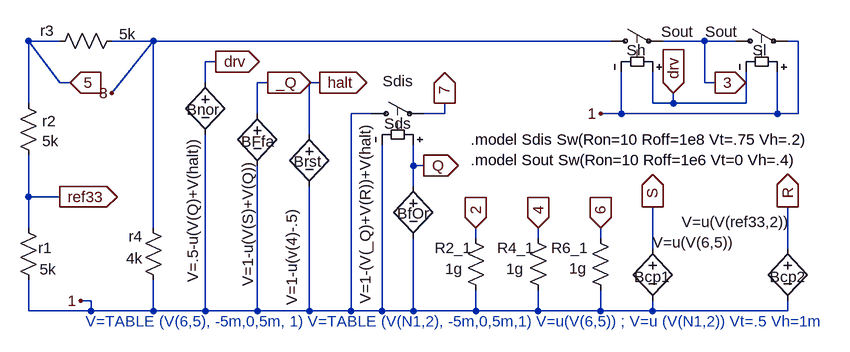
[diagram p0: schematic Lt555BehMin.asc]
Lt555BehMin.asc, the LTspice schematic file:
Version 4
SHEET 1 1704 916
WIRE -576 304 -576 208
WIRE -576 448 -576 384
WIRE -576 496 -576 448
WIRE -576 624 -576 576
WIRE -528 208 -576 208
WIRE -528 272 -576 208
WIRE -528 448 -576 448
WIRE -512 272 -528 272
WIRE -480 608 -496 608
WIRE -480 624 -576 624
WIRE -480 624 -480 608
WIRE -384 208 -448 208
WIRE -384 208 -448 288
WIRE -384 496 -384 208
WIRE -384 624 -480 624
WIRE -384 624 -384 576
WIRE -304 272 -304 240
WIRE -304 624 -384 624
WIRE -304 624 -304 352
WIRE -288 240 -304 240
WIRE -224 320 -224 272
WIRE -224 624 -304 624
WIRE -224 624 -224 400
WIRE -208 272 -224 272
WIRE -144 352 -144 272
WIRE -144 624 -224 624
WIRE -144 624 -144 432
WIRE -128 272 -144 272
WIRE -80 624 -144 624
WIRE -80 624 -80 320
WIRE -48 320 -80 320
WIRE -32 624 -80 624
WIRE -32 624 -32 368
WIRE 16 400 16 368
WIRE 16 432 16 400
WIRE 16 624 -32 624
WIRE 16 624 16 512
WIRE 32 400 16 400
WIRE 64 320 32 320
WIRE 64 320 64 304
WIRE 112 512 112 496
WIRE 112 624 16 624
WIRE 112 624 112 592
WIRE 208 512 208 496
WIRE 208 624 112 624
WIRE 208 624 208 592
WIRE 304 512 304 496
WIRE 304 624 208 624
WIRE 304 624 304 592
WIRE 320 208 -384 208
WIRE 336 320 304 320
WIRE 336 320 336 256
WIRE 384 304 384 256
WIRE 384 528 384 464
WIRE 384 624 304 624
WIRE 384 624 384 608
WIRE 416 304 384 304
WIRE 416 304 416 288
WIRE 464 208 400 208
WIRE 464 272 464 208
WIRE 480 272 464 272
WIRE 512 208 464 208
WIRE 528 304 416 304
WIRE 528 304 528 256
WIRE 576 320 336 320
WIRE 576 320 576 256
WIRE 592 528 592 464
WIRE 592 624 384 624
WIRE 592 624 592 608
WIRE 608 208 592 208
WIRE 608 320 576 320
WIRE 608 320 608 208
FLAG -528 448 ref33
IOPIN -528 448 Out
FLAG -512 272 5
IOPIN -512 272 In
FLAG 64 304 7
IOPIN 64 304 Out
FLAG 32 400 Q
IOPIN 32 400 Out
FLAG -448 288 8
FLAG 480 272 3
IOPIN 480 272 Out
FLAG 416 288 drv
IOPIN 416 288 In
FLAG -496 608 1
FLAG 208 496 4
IOPIN 208 496 In
FLAG 304 496 6
IOPIN 304 496 In
FLAG 384 464 S
IOPIN 384 464 Out
FLAG 112 496 2
IOPIN 112 496 In
FLAG 592 464 R
IOPIN 592 464 Out
FLAG -288 240 drv
IOPIN -288 240 Out
FLAG -208 272 _Q
IOPIN -208 272 Out
FLAG -128 272 halt
IOPIN -128 272 Out
FLAG 304 320 1
SYMBOL res -592 480 R0
WINDOW 0 31 47 Left 0
WINDOW 3 33 80 Left 0
SYMATTR InstName r1
SYMATTR Value 5k
SYMBOL res -592 288 R0
WINDOW 0 37 43 Left 0
WINDOW 3 37 74 Left 0
SYMATTR InstName r2
SYMATTR Value 5k
SYMBOL res -432 192 R90
WINDOW 0 16 115 VBottom 0
WINDOW 3 -10 -8 VTop 0
SYMATTR InstName r3
SYMATTR Value 5k
SYMBOL sw -64 320 R270
WINDOW 0 -15 35 VRight 0
WINDOW 3 50 33 VRight 0
SYMATTR InstName Sds
SYMATTR Value Sdis
SYMBOL sw 304 208 R270
WINDOW 0 -14 40 VRight 0
WINDOW 3 14 93 VRight 0
SYMATTR InstName Sh
SYMATTR Value Sout
SYMBOL sw 496 208 R270
WINDOW 0 -14 42 VRight 0
WINDOW 3 14 -31 VRight 0
SYMATTR InstName Sl
SYMATTR Value Sout
SYMBOL res -400 480 R0
WINDOW 0 -22 29 Left 0
WINDOW 3 -26 63 Left 0
SYMATTR InstName r4
SYMATTR Value 4k
SYMBOL res 96 496 R0
WINDOW 0 -47 31 Left 0
WINDOW 3 -31 63 Left 0
SYMATTR InstName R2_1
SYMATTR Value 1g
SYMBOL bv 384 512 R0
WINDOW 0 -28 59 Left 0
WINDOW 3 126 6 Right 0
SYMATTR InstName Bcp1
SYMATTR Value V=u(V(6,5))
SYMBOL bv 592 512 R0
WINDOW 0 -28 59 Left 0
WINDOW 3 -163 -25 Left 0
SYMATTR InstName Bcp2
SYMATTR Value V=u(V(ref33,2))
SYMBOL bv 16 416 R0
WINDOW 0 -25 58 Left 0
WINDOW 3 -74 -85 VRight 0
SYMATTR InstName BfOr
SYMATTR Value V=1-(V(_Q)+V(R))+V(halt)
SYMBOL bv -304 256 R0
WINDOW 0 -29 58 Left 0
WINDOW 3 -19 99 VRight 0
SYMATTR InstName Bnor
SYMATTR Value V=.5-u(V(Q)+V(halt))
SYMBOL bv -224 304 R0
WINDOW 0 -25 59 Left 0
WINDOW 3 -15 87 VRight 0
SYMATTR InstName BFfa
SYMATTR Value V=1-u(V(S)+V(Q))
SYMBOL bv -144 336 R0
WINDOW 0 -24 58 Left 0
WINDOW 3 -27 280 VLeft 0
SYMATTR InstName Brst
SYMATTR Value V=1-u(v(4)-.5)
SYMBOL res 288 496 R0
WINDOW 0 -2 31 Right 0
WINDOW 3 -32 62 Left 0
SYMATTR InstName R6_1
SYMATTR Value 1g
SYMBOL res 192 496 R0
WINDOW 0 -47 31 Left 0
WINDOW 3 -33 63 Left 0
SYMATTR InstName R4_1
SYMATTR Value 1g
TEXT 104 360 Left 0 !.model Sdis Sw(Ron=10 Roff=1e8 Vt=.75 Vh=.2)\n.model Sout Sw(Ron=10 Roff=1e6 Vt=0 Vh=.4)
TEXT -488 640 Left 0 ;V=TABLE (V(6,5), -5m,0,5m, 1) V=TABLE (V(N1,2), -5m,0,5m,1) V=u(V(6,5)) ; V=u (V(N1,2)) Vt=.5 Vh=1m

The netlist it stands for:
* Lt555BehMin.asc
r1 ref33 1 5k
r2 5 ref33 5k
r3 8 5 5k
Sds 1 7 Q 1 Sdis
Sh 8 3 drv 1 Sout
Sl 3 1 1 drv Sout
r4 8 1 4k
R2_1 2 1 1g
Bcp1 S 1 V=u(V(6,5))
Bcp2 R 1 V=u(V(ref33,2))
BfOr Q 1 V=1-(V(_Q)+V(R))+V(halt)
Bnor drv 1 V=.5-u(V(Q)+V(halt))
BFfa _Q 1 V=1-u(V(S)+V(Q))
Brst halt 1 V=1-u(v(4)-.5)
R6_1 6 1 1g
R4_1 4 1 1g
.model Sdis Sw(Ron=10 Roff=1e8 Vt=.75 Vh=.2)
.model Sout Sw(Ron=10 Roff=1e6 Vt=0 Vh=.4)
* V=TABLE (V(6,5), -5m,0,5m, 1) V=TABLE (V(N1,2), -5m,0,5m,1) V=u(V(6,5)) ; V=u (V(N1,2)) Vt=.5 Vh=1m
.backanno
.end